# Altium schematic sheet STM32F407.SchDoc
size D
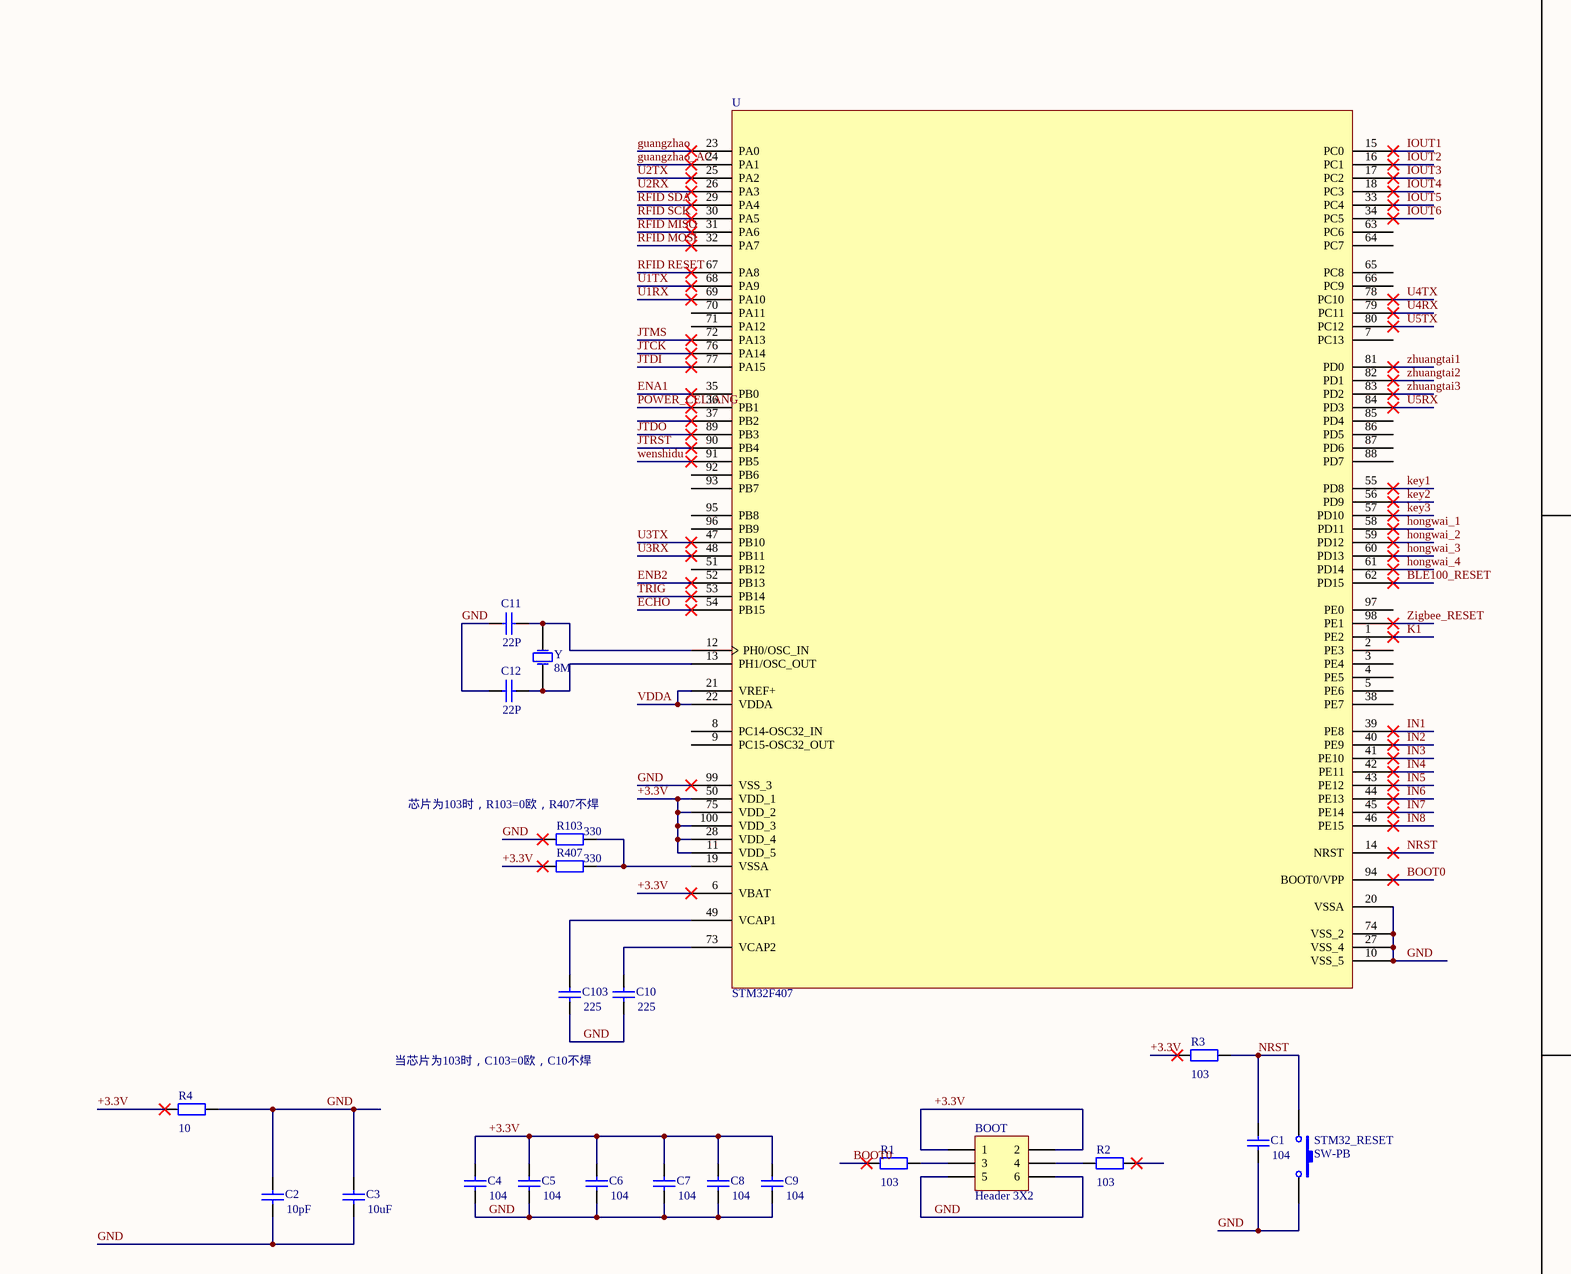
[diagram p0: STM32F407.SchDoc, top left]
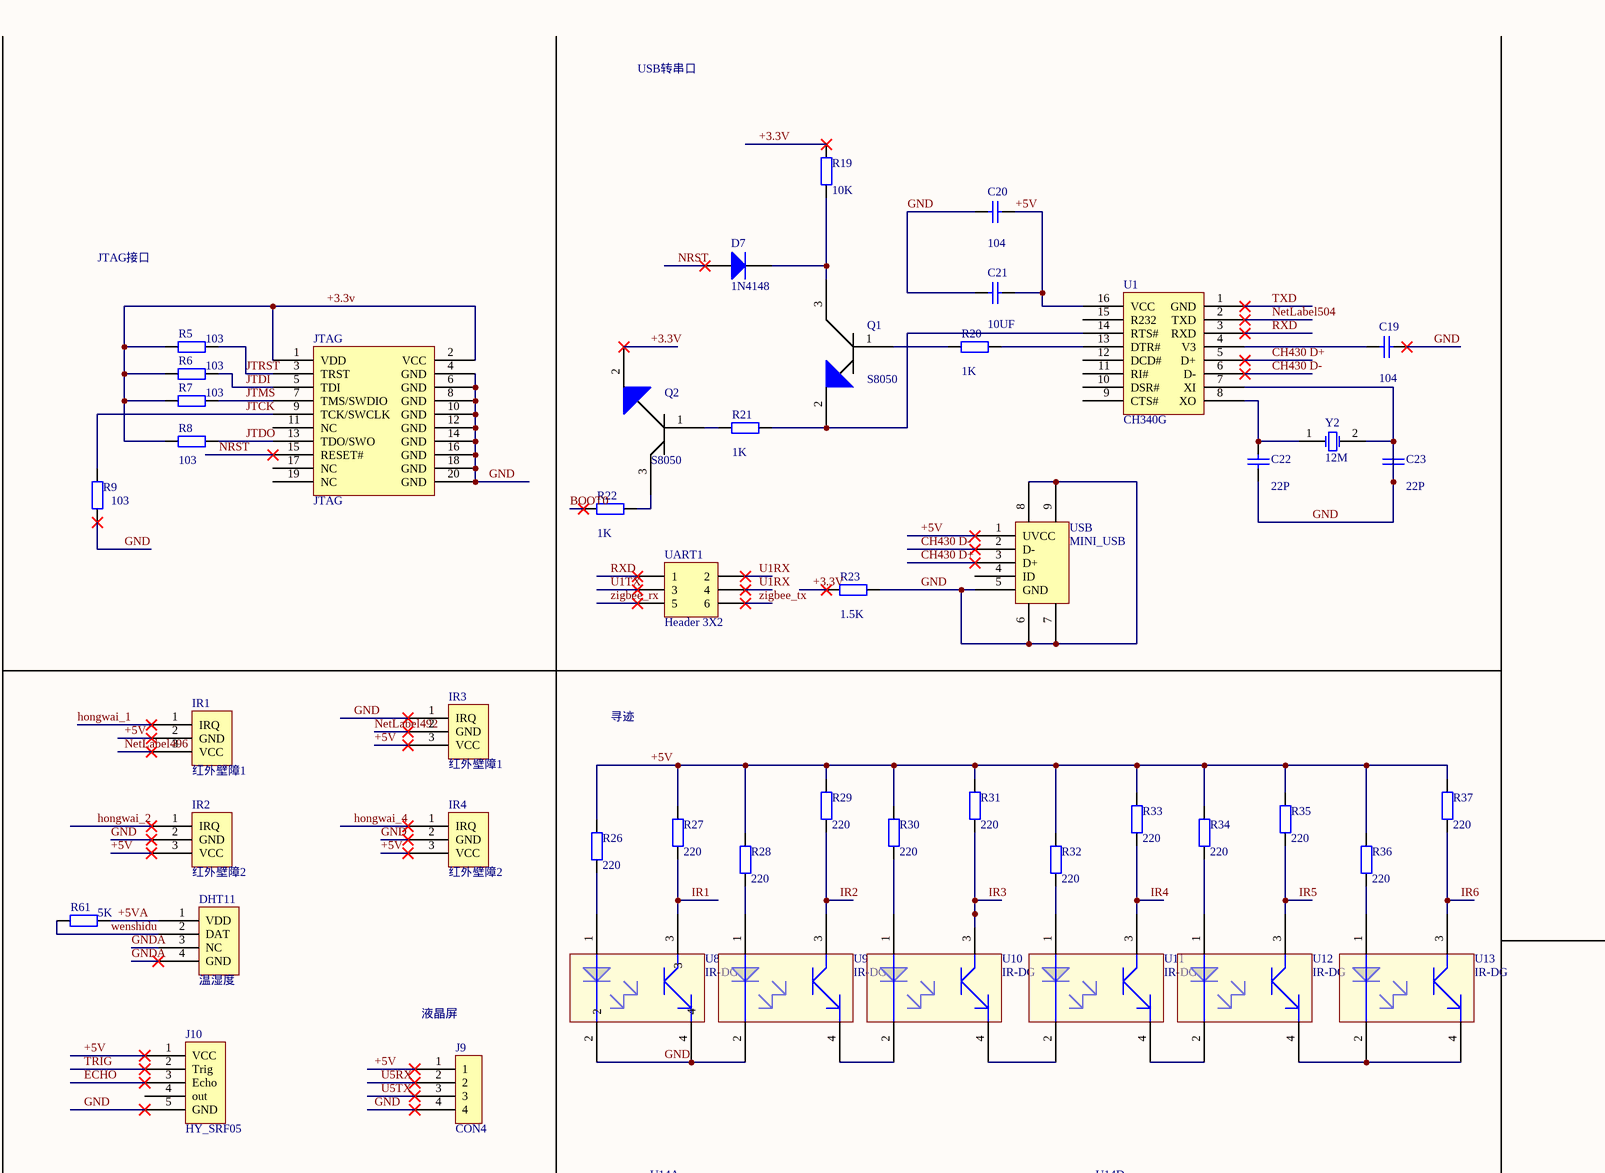
[diagram p1: STM32F407.SchDoc, top middle]
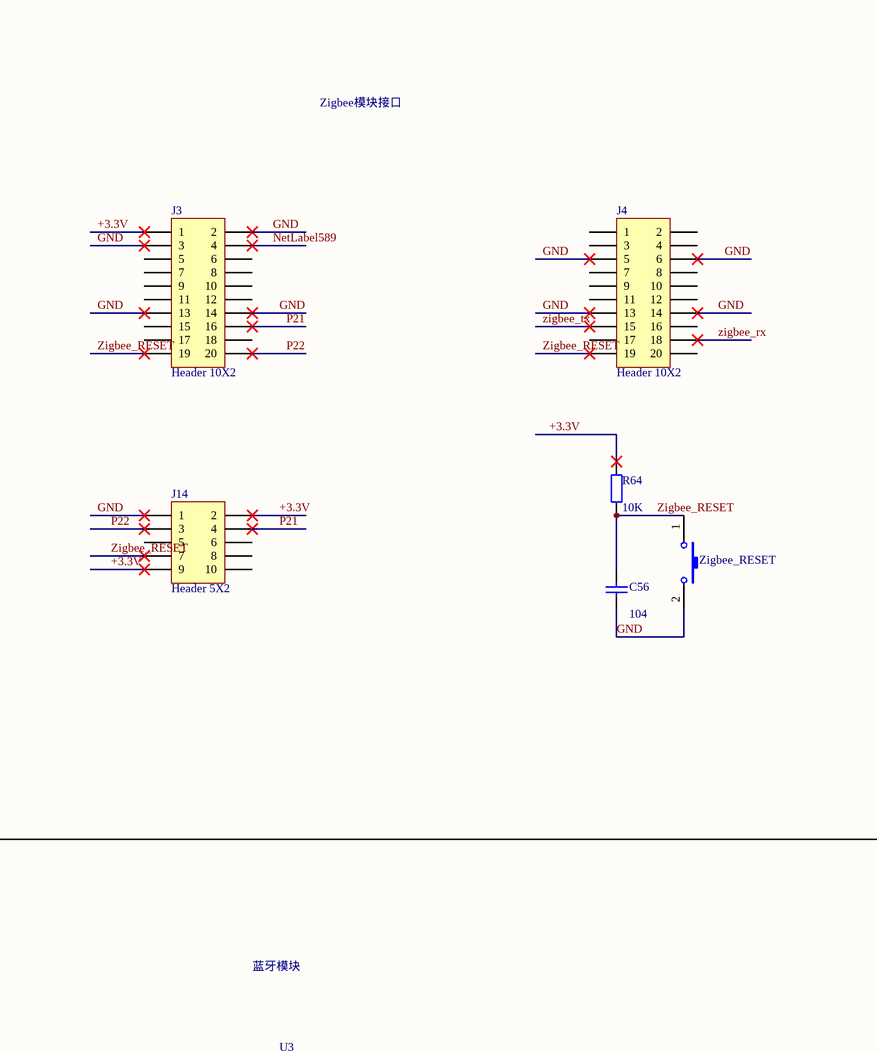
[diagram p2: STM32F407.SchDoc, top right]
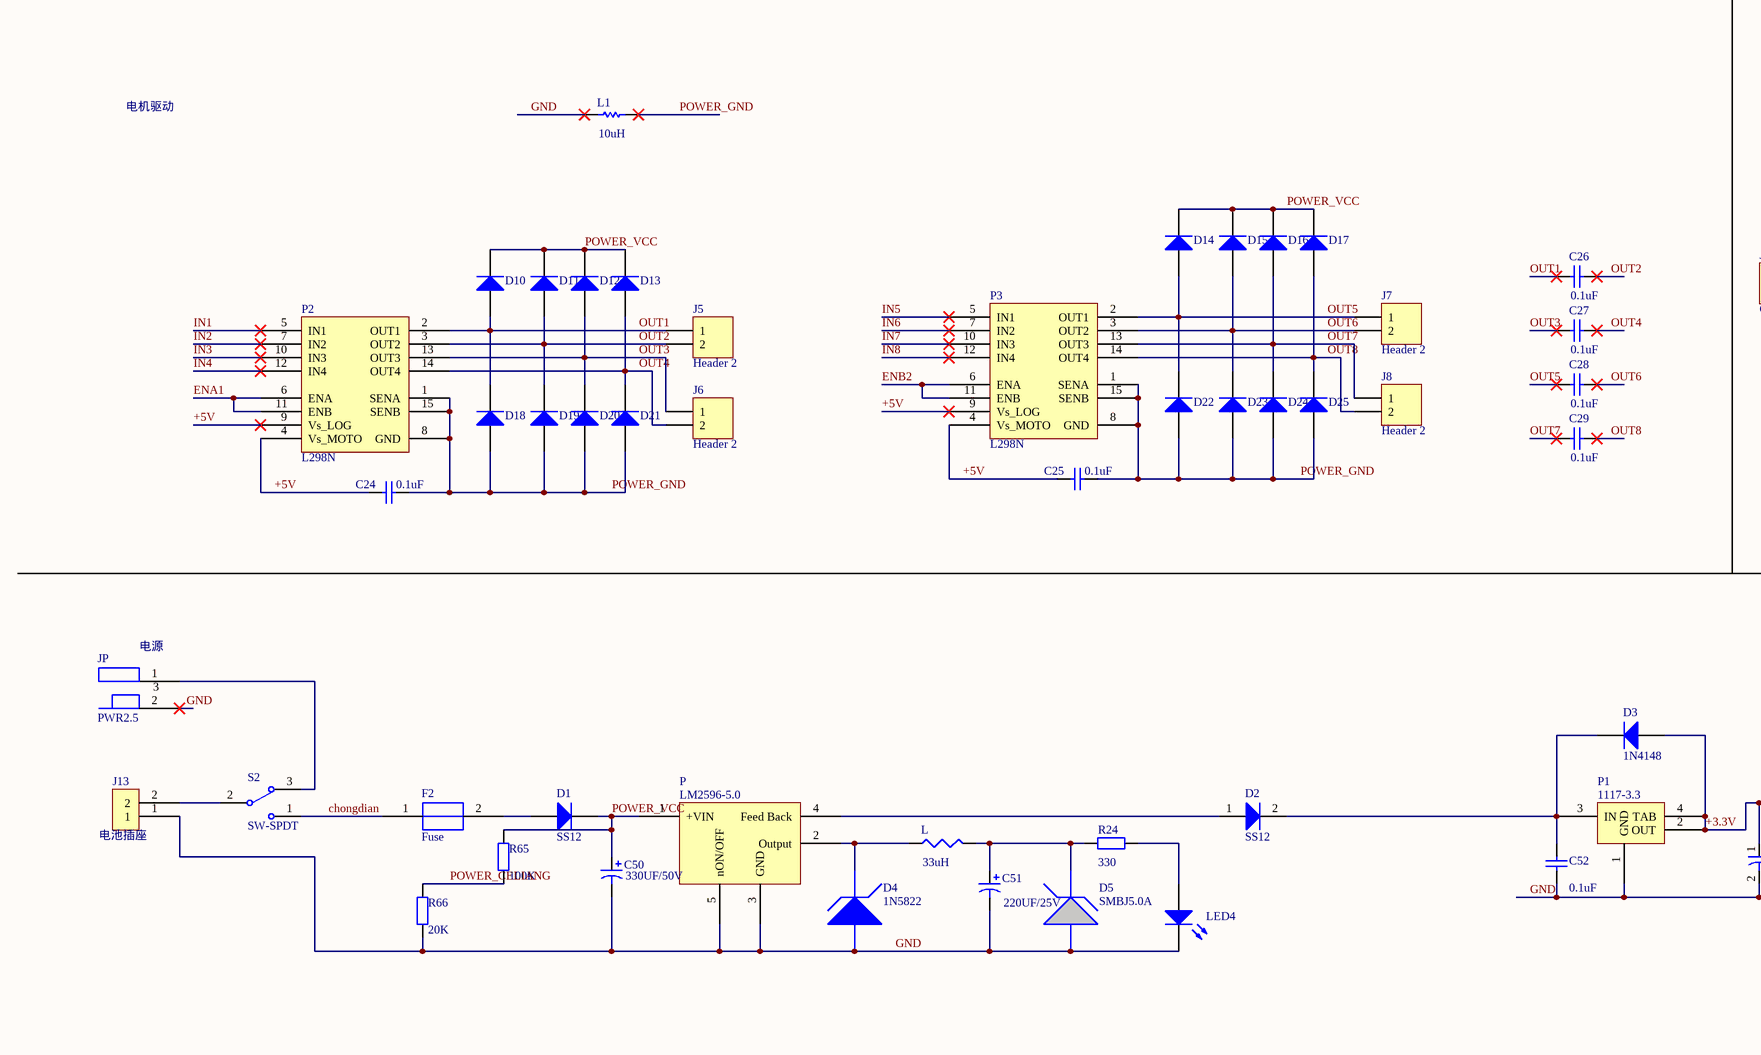
[diagram p3: STM32F407.SchDoc, bottom left]
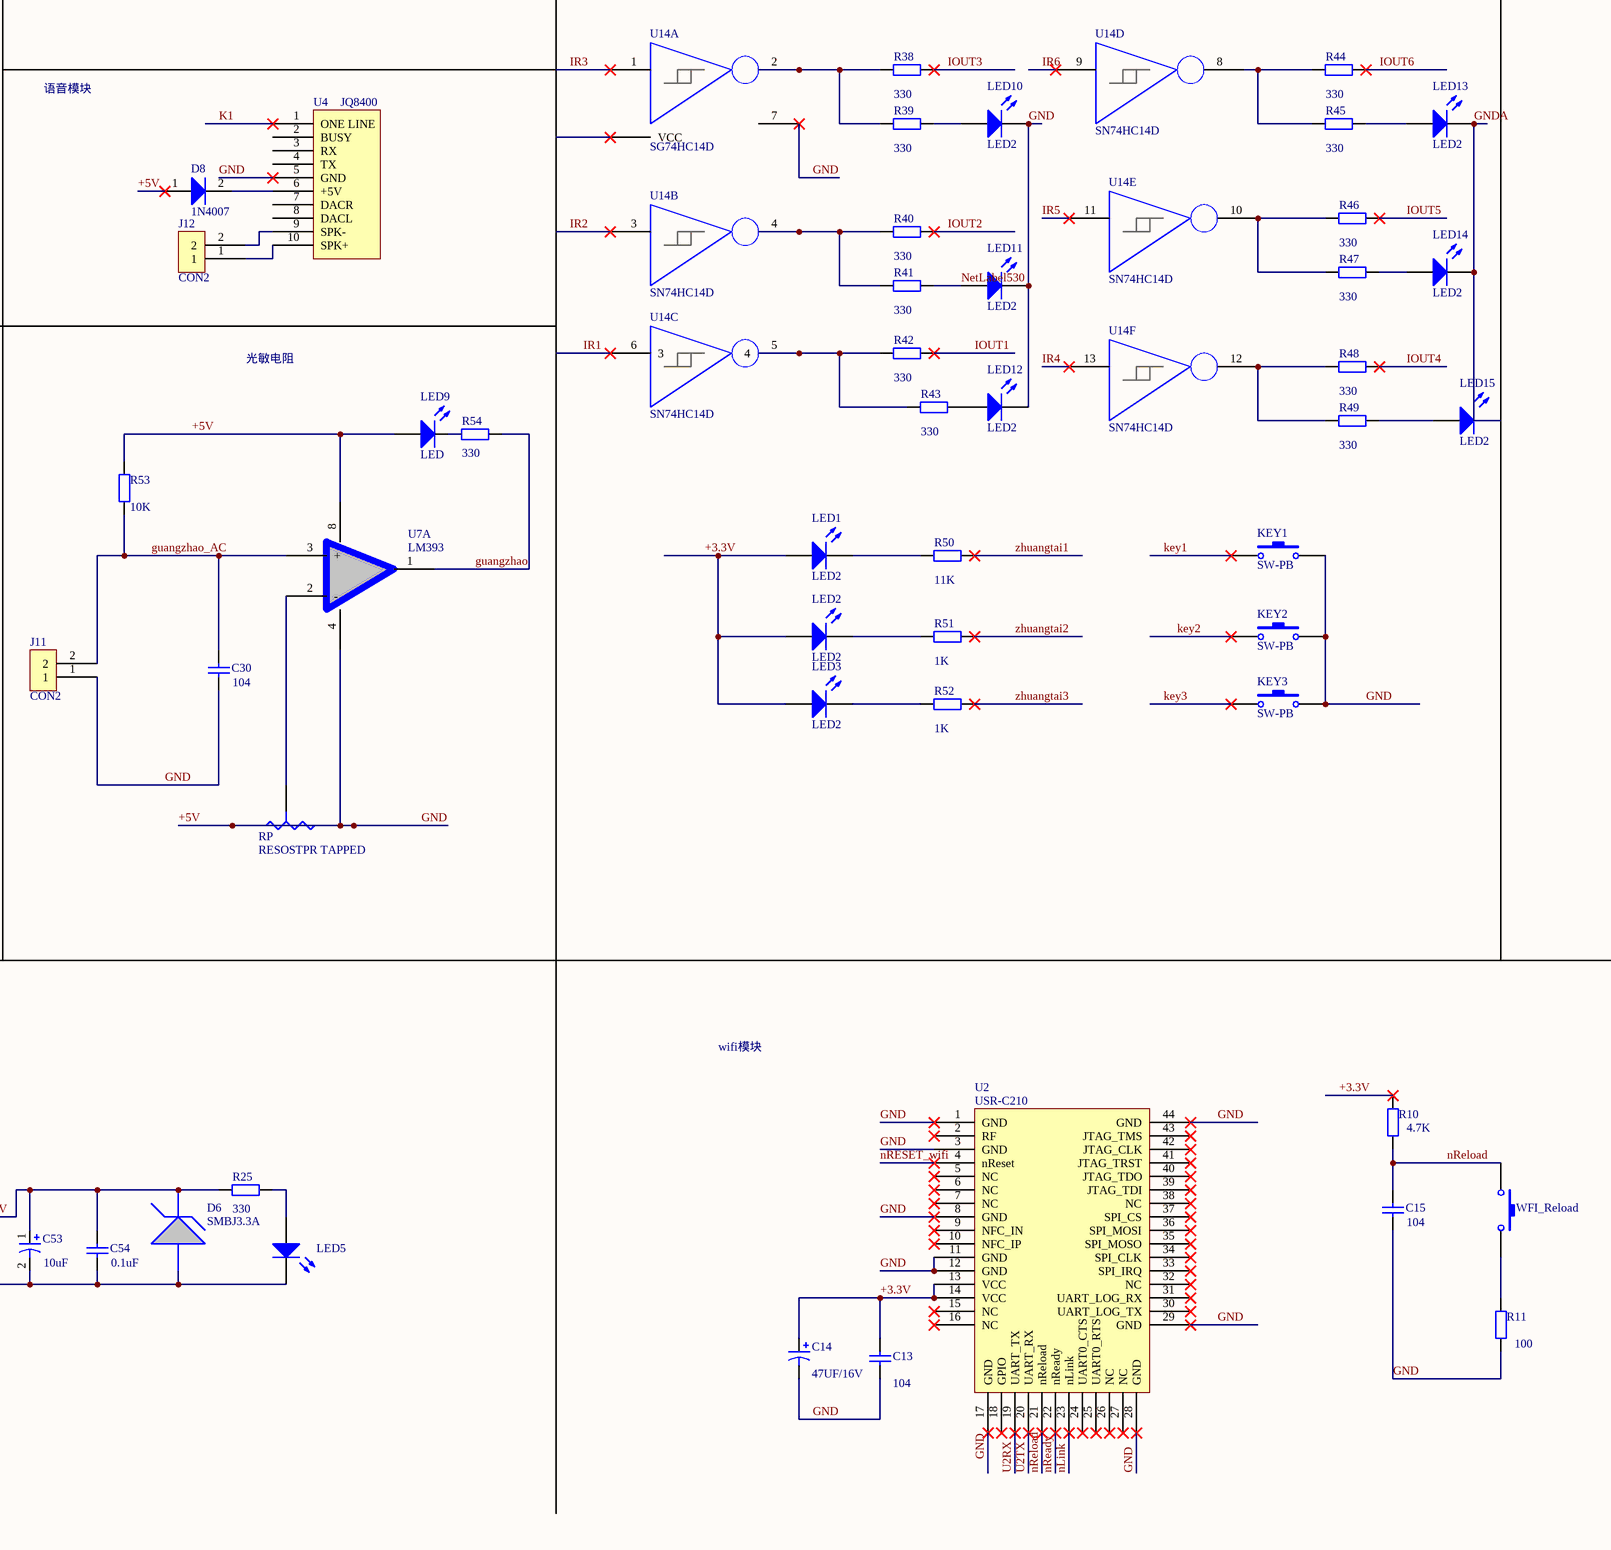
[diagram p4: STM32F407.SchDoc, bottom middle]
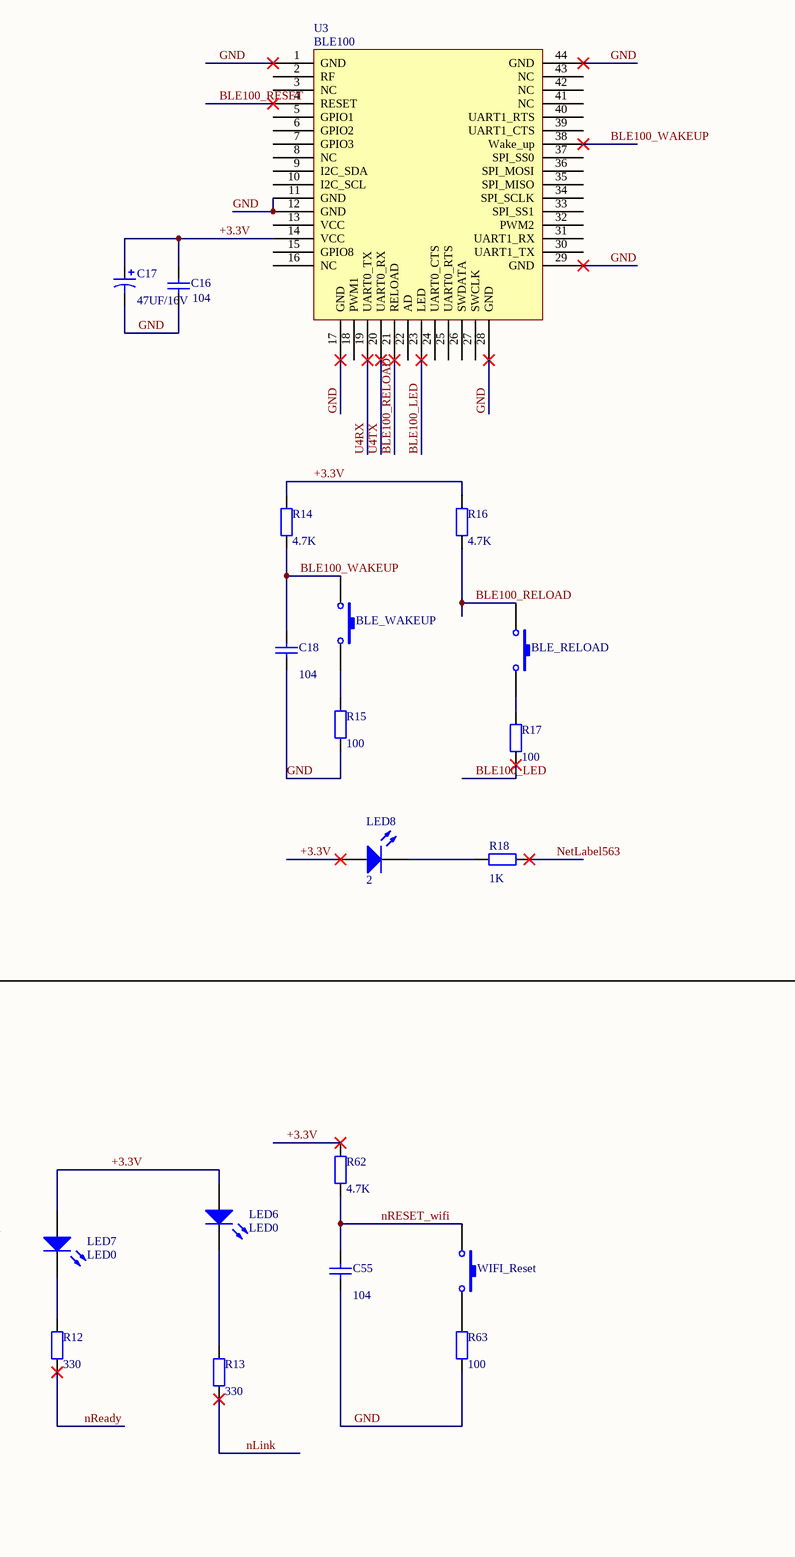
[diagram p5: STM32F407.SchDoc, bottom right]

## Parts
BLE_RELOAD  BLE_RELOAD  [Button_TP_L]
BLE_WAKEUP  BLE_WAKEUP  [Button_TP_L]
BOOT  Header 3X2  [HDR2X3]
C1  value 104  [1608[0603]C]
C2  value 10pF  [1608[0603]C]
C3  value 10uF  [1608[0603]C]
C4  value 104  [1608[0603]C]
C5  value 104  [1608[0603]C]
C6  value 104  [1608[0603]C]
C7  value 104  [1608[0603]C]
C8  value 104  [1608[0603]C]
C9  value 104  [1608[0603]C]
C10  value 225  [1608[0603]C]
C11  value 22P  [1608[0603]C]
C12  value 22P  [1608[0603]C]
C13  value 104  [1608[0603]C]  (hidden comment: Cap)
C14  value 47UF/16V  [3216[1206]C]  (hidden comment: Cap Pol1)
C15  value 104  [1608[0603]C]  (hidden comment: Cap)
C16  value 104  [1608[0603]C]  (hidden comment: Cap)
C17  value 47UF/16V  [3216[1206]C]  (hidden comment: Cap Pol1)
C18  value 104  [1608[0603]C]  (hidden comment: Cap)
C19  value 104  [RAD-0.3]  (hidden comment: Cap)
C20  value 104  [1608[0603]C]  (hidden comment: Cap)
C21  value 10UF  [1608[0603]C]  (hidden comment: Cap)
C22  value 22P  [1608[0603]C]  (hidden comment: Cap)
C23  value 22P  [1608[0603]C]  (hidden comment: Cap)
C24  value 0.1uF  [RAD-0.3]
C25  value 0.1uF  [RAD-0.3]
C26  value 0.1uF  [1608[0603]C]  (hidden comment: Cap)
C27  value 0.1uF  [1608[0603]C]  (hidden comment: Cap)
C28  value 0.1uF  [1608[0603]C]  (hidden comment: Cap)
C29  value 0.1uF  [1608[0603]C]  (hidden comment: Cap)
C30  value 104  [1608[0603]C]
C50  value 330UF/50V  [3216[1206]C]  (hidden comment: Cap Pol1)
C51  value 220UF/25V  [3216[1206]C]  (hidden comment: Cap Pol1)
C52  value 0.1uF  [1608[0603]C]  (hidden comment: Cap)
C53  value 10uF  [3216[1206]C]  (hidden comment: Cap Pol1)
C54  value 0.1uF  [1608[0603]C]  (hidden comment: Cap)
C55  value 104  [1608[0603]C]  (hidden comment: Cap)
C56  value 104  [1608[0603]C]  (hidden comment: Cap)
C103  value 225  [1608[0603]C]
D1  SS12  [DIODE-T]
D2  SS12  [DIODE-T]
D3  1N4148  [DIODE-T]
D4  1N5822  [DIODE-7/3]
D5  SMBJ5.0A  [DIODE-7/3]
D6  SMBJ3.3A  [DIODE-7/3]
D7  1N4148  [DIODE-T]
D8  1N4007  [DIODE-7/3]
D10  Diode  [DIODE-T]  (value not drawn)
D11  Diode  [DIODE-T]  (value not drawn)
D12  Diode  [DIODE-T]  (value not drawn)
D13  Diode  [DIODE-T]  (value not drawn)
D14  Diode  [DIODE-T]  (value not drawn)
D15  Diode  [DIODE-T]  (value not drawn)
D16  Diode  [DIODE-T]  (value not drawn)
D17  Diode  [DIODE-T]  (value not drawn)
D18  Diode  [DIODE-T]  (value not drawn)
D19  Diode  [DIODE-T]  (value not drawn)
D20  Diode  [DIODE-T]  (value not drawn)
D21  Diode  [DIODE-T]  (value not drawn)
D22  Diode  [DIODE-T]  (value not drawn)
D23  Diode  [DIODE-T]  (value not drawn)
D24  Diode  [DIODE-T]  (value not drawn)
D25  Diode  [DIODE-T]  (value not drawn)
DHT11  温湿度  [DHT11]
F2  Fuse  [FUSE]
IR1  红外壁障1  [IR]
IR2  红外壁障2  [IR]
IR3  红外壁障1  [IR]
IR4  红外壁障2  [IR]
J3  Header 10X2  [HDR2X10]
J4  Header 10X2  [HDR2X10]
J5  Header 2  [HDR1X2]
J6  Header 2  [HDR1X2]
J7  Header 2  [HDR1X2]
J8  Header 2  [HDR1X2]
J9  CON4  [液晶屏3.5]
J10  HY_SRF05  [RELAY5]
J11  CON2  [HDR1X2]
J12  CON2  [HDR1X2]
J13  电池插座  [电源座子]  (value not drawn)
J14  Header 5X2  [HDR2X5]
JP  PWR2.5  [SIP2]
JTAG  JTAG  [JTAG_20]
KEY1  SW-PB  [Button_TP_L]
KEY2  SW-PB  [Button_TP_L]
KEY3  SW-PB  [Button_TP_L]
L  value 33uH  [FCC05-20A]
L1  value 10uH  [FCC05-20A]
LED1  LED2  [1608[0603]LED]
LED2  LED2  [1608[0603]LED]
LED3  LED2  [1608[0603]LED]
LED4  LED4  [1608[0603]LED]
LED5  LED0  [1608[0603]LED]  (value not drawn)
LED6  LED0  [1608[0603]LED]
LED7  LED0  [1608[0603]LED]
LED8  2  [1608[0603]LED]
LED9  LED  [1608[0603]LED]
LED10  LED2  [1608[0603]LED]
LED11  LED2  [1608[0603]LED]
LED12  LED2  [1608[0603]LED]
LED13  LED2  [1608[0603]LED]
LED14  LED2  [1608[0603]LED]
LED15  LED2  [1608[0603]LED]
P  LM2596-5.0  [LM2596]
P1  1117-3.3  [SOT-23]
P2  L298N  [L298N]
P3  L298N  [L298N]
Q1  S8050  [TO-92]
Q2  S8050  [TO-92]
R1  value 103  [1608[0603]R]
R2  value 103  [1608[0603]R]
R3  value 103  [1608[0603]R]
R4  value 10  [1608[0603]R]
R5  value 103  [1608[0603]R]
R6  value 103  [1608[0603]R]
R7  value 103  [1608[0603]R]
R8  value 103  [1608[0603]R]
R9  value 103  [1608[0603]R]
R10  value 4.7K  [1608[0603]R]  (hidden comment: Res2)
R11  value 100  [1608[0603]R]  (hidden comment: Res2)
R12  value 330  [1608[0603]R]  (hidden comment: Res2)
R13  330  [1608[0603]R]
R14  value 4.7K  [1608[0603]R]  (hidden comment: Res2)
R15  value 100  [1608[0603]R]  (hidden comment: Res2)
R16  value 4.7K  [1608[0603]R]  (hidden comment: Res2)
R17  value 100  [1608[0603]R]  (hidden comment: Res2)
R18  value 1K  [1608[0603]R]  (hidden comment: Res2)
R19  value 10K  [1608[0603]R]  (hidden comment: Res2)
R20  value 1K  [1608[0603]R]  (hidden comment: Res2)
R21  value 1K  [AXIAL-0.4]  (hidden comment: Res2)
R22  value 1K  [1608[0603]R]  (hidden comment: Res2)
R23  value 1.5K  [1608[0603]R]  (hidden comment: Res2)
R24  value 330  [1608[0603]R]  (hidden comment: Res2)
R25  value 330  [1608[0603]R]  (hidden comment: Res2)
R26  value 220  [1608[0603]R]  (hidden comment: Res2)
R27  value 220  [1608[0603]R]  (hidden comment: Res2)
R28  value 220  [1608[0603]R]  (hidden comment: Res2)
R29  value 220  [1608[0603]R]  (hidden comment: Res2)
R30  value 220  [1608[0603]R]  (hidden comment: Res2)
R31  value 220  [1608[0603]R]  (hidden comment: Res2)
R32  value 220  [1608[0603]R]  (hidden comment: Res2)
R33  value 220  [1608[0603]R]  (hidden comment: Res2)
R34  value 220  [1608[0603]R]  (hidden comment: Res2)
R35  value 220  [1608[0603]R]  (hidden comment: Res2)
R36  value 220  [1608[0603]R]  (hidden comment: Res2)
R37  value 220  [1608[0603]R]  (hidden comment: Res2)
R38  value 330  [1608[0603]R]  (hidden comment: Res2)
R39  value 330  [1608[0603]R]  (hidden comment: Res2)
R40  value 330  [1608[0603]R]  (hidden comment: Res2)
R41  value 330  [1608[0603]R]  (hidden comment: Res2)
R42  value 330  [1608[0603]R]  (hidden comment: Res2)
R43  value 330  [1608[0603]R]  (hidden comment: Res2)
R44  value 330  [1608[0603]R]  (hidden comment: Res2)
R45  value 330  [1608[0603]R]  (hidden comment: Res2)
R46  value 330  [1608[0603]R]  (hidden comment: Res2)
R47  value 330  [1608[0603]R]  (hidden comment: Res2)
R48  value 330  [1608[0603]R]  (hidden comment: Res2)
R49  value 330  [1608[0603]R]  (hidden comment: Res2)
R50  value 11K  [1608[0603]R]  (hidden comment: Res2)
R51  value 1K  [1608[0603]R]  (hidden comment: Res2)
R52  value 1K  [1608[0603]R]  (hidden comment: Res2)
R53  value 10K  [1608[0603]R]  (hidden comment: Res2)
R54  value 330  [1608[0603]R]
R61  value 5K  [AXIAL-0.4]
R62  value 4.7K  [1608[0603]R]  (hidden comment: Res2)
R63  value 100  [AXIAL-0.4]  (hidden comment: Res2)
R64  value 10K  [1608[0603]R]  (hidden comment: Res2)
R65  value 100K  [1608[0603]R]  (hidden comment: Res2)
R66  value 20K  [1608[0603]R]  (hidden comment: Res2)
R103  value 330  [1608[0603]R]
R407  value 330  [1608[0603]R]
RP  RESOSTPR TAPPED  [SOT-23]
S2  SW-SPDT  [SIP3]
STM32_RESET  SW-PB  [SIP2]
U  STM32F407  [STM-LQFP100_M]
U1  CH340G  [SOP16]
U2  USR-C210  [USR-C322-PCB]
U3  BLE100  [USR-C322-PCB]
U4  JQ8400  [JQ8400]
U7A  LM393  [SOP-8]
U8  IR-DG  [IR]
U9  IR-DG  [IR]
U10  IR-DG  [IR]
U11  IR-DG  [IR]
U12  IR-DG  [IR]
U13  IR-DG  [IR]
U14A  SG74HC14D  [SOP16]
U14B  SN74HC14D  [SOP14S]
U14C  SN74HC14D  [SOP14S]
U14D  SN74HC14D  [SOP14S]
U14E  SN74HC14D  [SOP14S]
U14F  SN74HC14D  [SOP14S]
UART1  Header 3X2  [HDR2X3]
USB  MINI_USB  [USB-MINI]
WFI_Reload  WFI_Reload  [Button_TP_L]
WIFI_Reset  WIFI_Reset  [Button_TP_L]
Y  8M  [CRYSTAL]
Y2  12M  [XTAL_US]
Zigbee_RESET  Zigbee_RESET  [Button_TP_L]

## Nets
+3.3V: BOOT.1 BOOT.2 C4.2 C5.2 C6.2 C7.2 C8.2 C9.2 C13.2 C14.1 C16.2 C17.1 C53.1 C54.2 D3.1(A) D6.2 J3.1 J14.2 J14.9 JTAG.1(VDD) JTAG.2(VCC) LED1.1(A) LED2.1(A) LED3.1(A) LED6.1(A) LED7.1(A) LED8.1(A) P1.2(OUT) P1.4(TAB) Q2.2 R3.1 R4.1 R5.1 R6.1 R7.1 R8.1 R10.2 R14.2 R16.2 R19.2 R23.1 R25.1 R62.1 R64.2 R407.1 U.6(VBAT) U.11(VDD_5) U.28(VDD_4) U.50(VDD_1) U.75(VDD_2) U.100(VDD_3) U2.13(VCC) U2.14(VCC) U3.14(VCC)
+5V: BOOT.5 BOOT.6 C1.1 C2.1 C2.2 C3.1 C3.2 C4.1 C5.1 C6.1 C7.1 C8.1 C9.1 C10.1 C11.1 C12.1 C13.1 C14.2 C15.2 C16.1 C17.2 C18.2 C19.2 C20.1 C20.2 C21.1 C21.2 C22.1 C23.1 C23.2 C24.1 C25.1 C30.1 C50.2 C51.2 C52.1 C53.2 C54.1 C55.1 C56.1 C103.1 D4.1 D5.1 D6.1 D8.1(A) IR1.2(GND) IR2.2(GND) IR2.3(VCC) IR3.1(IRQ) IR3.3(VCC) IR4.2(GND) IR4.3(VCC) J3.2 J3.3 J3.13 J3.14 J4.5 J4.6 J4.13 J4.14 J9.1 J9.4 J10.1(VCC) J10.5(GND) J11.1 J13.1 J14.1 JP.2 JTAG.4(GND) JTAG.6(GND) JTAG.8(GND) JTAG.10(GND) JTAG.12(GND) JTAG.14(GND) JTAG.16(GND) JTAG.18(GND) JTAG.20(GND) KEY1.2 KEY2.2 KEY3.2 L1.1 LED4.2(K) LED5.2(K) LED9.1(A) LED10.2(K) LED11.2(K) LED12.2(K) P.3(GND) P.5(nON/OFF) P1.1(GND) P2.4(Vs_MOTO) P2.9(Vs_LOG) P3.4(Vs_MOTO) P3.9(Vs_LOG) R4.2 R9.1 R11.1 R15.1 R23.2 R26.2 R27.2 R28.2 R29.2 R30.2 R31.2 R32.2 R33.2 R34.2 R35.2 R36.2 R37.2 R53.2 R63.1 R66.1 R103.1 RP.1(A) RP.2(B) STM32_RESET.2 U.10(VSS_5) U.20(VSSA) U.27(VSS_4) U.74(VSS_2) U.99(VSS_3) U1.7(XI) U1.16(VCC) U2.1(GND) U2.3(GND) U2.8(GND) U2.11(GND) U2.12(GND) U2.17(GND) U2.28(GND) U2.29(GND) U2.44(GND) U3.1(GND) U3.11(GND) U3.12(GND) U3.17(GND) U3.28(GND) U3.29(GND) U3.44(GND) U4.5(GND) U7A.4 U7A.8 U8.2 U8.4 U9.2 U14A.7 USB.1(UVCC) USB.5(GND) USB.6 USB.7 USB.8 USB.9 Y2.2(OSC2) Zigbee_RESET.2  [also labelled GND]
+5VA: DHT11.1(VDD) R61.2
BLE100_LED: R17.1 U3.23(LED)
BLE100_RELOAD: BLE_RELOAD.1 R16.1 U3.21(RELOAD)
BLE100_RESET: U.62(PD15) U3.4(RESET)
BLE100_WAKEUP: BLE_WAKEUP.1 C18.1 R14.1 U3.38(Wake_up)
BOOT0: R1.1 R22.1 U.94(BOOT0/VPP)
CH430 D+: U1.5(D+) USB.3(D+)
CH430 D-: U1.6(D-) USB.2(D-)
chongdian: F2.1 S2.1
ECHO: J10.3(Echo) U.54(PB15)
ENA1: P2.6(ENA) P2.11(ENB) U.35(PB0)
ENB2: P3.6(ENA) P3.11(ENB) U.52(PB13)
GNDA: DHT11.3(NC) DHT11.4(GND) LED13.2(K) LED14.2(K) LED15.2(K)
guangzhao: R54.2 U.23(PA0) U7A.1
guangzhao_AC: C30.2 J11.2 R53.1 U.24(PA1) U7A.3(+)
hongwai_1: IR1.1(IRQ) U.58(PD11)
hongwai_2: IR2.1(IRQ) U.59(PD12)
hongwai_3: U.60(PD13)
hongwai_4: IR4.1(IRQ) U.61(PD14)
IN1: P2.5(IN1) U.39(PE8)
IN2: P2.7(IN2) U.40(PE9)
IN3: P2.10(IN3) U.41(PE10)
IN4: P2.12(IN4) U.42(PE11)
IN5: P3.5(IN1) U.43(PE12)
IN6: P3.7(IN2) U.44(PE13)
IN7: P3.10(IN3) U.45(PE14)
IN8: P3.12(IN4) U.46(PE15)
IOUT1: R42.2 U.15(PC0)
IOUT2: R40.2 U.16(PC1)
IOUT3: R38.2 U.17(PC2)
IOUT4: R48.2 U.18(PC3)
IOUT5: R46.2 U.33(PC4)
IOUT6: R44.2 U.34(PC5)
IR1: R27.1 U8.3 U14C.6(3)
IR2: R29.1 U9.3 U14B.3
IR3: R31.1 U10.3 U14A.1
IR4: R33.1 U11.3 U14F.13
IR5: R35.1 U12.3 U14E.11
IR6: R37.1 U13.3 U14D.9
JTCK: JTAG.9(TCK/SWCLK) R9.2 U.76(PA14)
JTDI: JTAG.5(TDI) R6.2 U.77(PA15)
JTDO: JTAG.13(TDO/SWO) R8.2 U.89(PB3)
JTMS: JTAG.7(TMS/SWDIO) R7.2 U.72(PA13)
JTRST: JTAG.3(TRST) R5.2 U.90(PB4)
K1: U.1(PE2) U4.1(ONE_LINE)
key1: KEY1.1 U.55(PD8)
key2: KEY2.1 U.56(PD9)
key3: KEY3.1 U.57(PD10)
NetLabel492: IR3.2(GND)
NetLabel496: IR1.3(VCC)
NetLabel504: U1.2(TXD)
NetLabel530: LED11.1(A) R41.2
NetLabel563: R18.2
NetLabel589: J3.4
nLink: R13.1 U2.23(nLink)
nReady: R12.1 U2.22(nReady)
nReload: C15.1 R10.1 U2.21(nReload) WFI_Reload.1
nRESET_wifi: C55.2 R62.2 U2.4(nReset) WIFI_Reset.1
NRST: C1.2 D7.1(A) JTAG.15(RESET#) R3.2 STM32_RESET.1 U.14(NRST)
OUT1: C26.1 D10.1(A) D18.2(K) J5.1 P2.2(OUT1)
OUT2: C26.2 D11.1(A) D19.2(K) J5.2 P2.3(OUT2)
OUT3: C27.1 D12.1(A) D20.2(K) J6.1 P2.13(OUT3)
OUT4: C27.2 D13.1(A) D21.2(K) J6.2 P2.14(OUT4)
OUT5: C28.1 D14.1(A) D22.2(K) J7.1 P3.2(OUT1)
OUT6: C28.2 D15.1(A) D23.2(K) J7.2 P3.3(OUT2)
OUT7: C29.1 D16.1(A) D24.2(K) J8.1 P3.13(OUT3)
OUT8: C29.2 D17.1(A) D25.2(K) J8.2 P3.14(OUT4)
P21: J3.16 J14.4
P22: J3.20 J14.3
POWER_CELIANG: R65.1 R66.2 U.36(PB1)
POWER_GND: C24.2 C25.2 D18.1(A) D19.1(A) D20.1(A) D21.1(A) D22.1(A) D23.1(A) D24.1(A) D25.1(A) L1.2 P2.1(SENA) P2.8(GND) P2.15(SENB) P3.1(SENA) P3.8(GND) P3.15(SENB)
POWER_VCC: C50.1 D1.2(K) D10.2(K) D11.2(K) D12.2(K) D13.2(K) D14.2(K) D15.2(K) D16.2(K) D17.2(K) P.1(+VIN) R65.2
RFID MISO: U.31(PA6)
RFID MOSI: U.32(PA7)
RFID RESET: U.67(PA8)
RFID SCK: U.30(PA5)
RFID SDA: U.29(PA4)
RXD: U1.3(RXD) UART1.1
TRIG: J10.2(Trig) U.53(PB14)
TXD: U1.1(GND)
U1RX: U.69(PA10) UART1.2 UART1.4
U1TX: U.68(PA9) UART1.3
U2RX: U.26(PA3) U2.19(UART_TX)
U2TX: U.25(PA2) U2.20(UART_RX)
U3RX: U.48(PB11)
U3TX: U.47(PB10)
U4RX: U.79(PC11) U3.19(UART0_TX)
U4TX: U.78(PC10) U3.20(UART0_RX)
U5RX: J9.2 U.84(PD3)
U5TX: J9.3 U.80(PC12)
VDDA: U.21(VREF+) U.22(VDDA)
wenshidu: DHT11.2(DAT) R61.1 U.91(PB5)
zhuangtai1: R50.2 U.81(PD0)
zhuangtai2: R51.2 U.82(PD1)
zhuangtai3: R52.2 U.83(PD2)
Zigbee_RESET: C56.2 J3.19 J4.19 J14.7 R64.1 U.98(PE1) Zigbee_RESET.1
zigbee_rx: J4.18 UART1.5
zigbee_tx: J4.15 UART1.6
NetBLE_RELOAD_2: BLE_RELOAD.2 R17.2
NetBLE_WAKEUP_2: BLE_WAKEUP.2 R15.2
NetBOOT_3: BOOT.3 R1.2
NetBOOT_4: BOOT.4 R2.1
NetC10_2: C10.2 U.73(VCAP2)
NetC11_2: C11.2 U.12(PH0/OSC_IN) Y.1(OSC1)
NetC12_2: C12.2 U.13(PH1/OSC_OUT) Y.2(OSC2)
NetC19_1: C19.1 U1.4(V3)
NetC22_2: C22.2 U1.8(XO) Y2.1(OSC1)
NetC51_1: C51.1 D5.2 L.2 R24.1
NetC52_2: C52.2 D2.2(K) D3.2(K) P1.3(IN)
NetC103_2: C103.2 U.49(VCAP1)
NetD1_1: D1.1(A) F2.2
NetD2_1: D2.1(A) P.4(Feed_Back)
NetD4_2: D4.2 L.1 P.2(Output)
NetD7_2: D7.2(K) Q1.3 R19.1
NetD8_2: D8.2(K) U4.6(+5V)
NetJ12_1: J12.1 U4.10(SPK+)
NetJ12_2: J12.2 U4.9(SPK-)
NetJ13_2: J13.2 S2.2
NetJP_1: JP.1 S2.3
NetLED1_2: LED1.2(K) R50.1
NetLED2_2: LED2.2(K) R51.1
NetLED3_2: LED3.2(K) R52.1
NetLED4_1: LED4.1(A) R24.2
NetLED5_1: LED5.1(A) R25.2
NetLED6_2: LED6.2(K) R13.2
NetLED7_2: LED7.2(K) R12.2
NetLED8_2: LED8.2(K) R18.1
NetLED9_2: LED9.2(K) R54.1
NetLED10_1: LED10.1(A) R39.2
NetLED12_1: LED12.1(A) R43.2
NetLED13_1: LED13.1(A) R45.2
NetLED14_1: LED14.1(A) R47.2
NetLED15_1: LED15.1(A) R49.2
NetQ1_1: Q1.1 R20.1
NetQ1_2: Q1.2 R21.2 U1.14(RTS#)
NetQ2_1: Q2.1 R21.1
NetQ2_3: Q2.3 R22.2
NetR11_2: R11.2 WFI_Reload.2
NetR20_2: R20.2 U1.13(DTR#)
NetR26_1: R26.1 U8.1
NetR28_1: R28.1 U9.1
NetR30_1: R30.1 U10.1
NetR32_1: R32.1 U11.1
NetR34_1: R34.1 U12.1
NetR36_1: R36.1 U13.1
NetR38_1: R38.1 R39.1 U14A.2
NetR40_1: R40.1 R41.1 U14B.4
NetR42_1: R42.1 R43.1 U14C.5(4)
NetR44_1: R44.1 R45.1 U14D.8
NetR46_1: R46.1 R47.1 U14E.10
NetR48_1: R48.1 R49.1 U14F.12
NetR63_2: R63.2 WIFI_Reset.2
NetR103_2: R103.2 R407.2 U.19(VSSA)
NetRP_3: RP.3(TAP) U7A.2(-)
NetU9_4: U9.4 U10.2
NetU10_4: U10.4 U11.2
NetU11_4: U11.4 U12.2
NetU12_4: U12.4 U13.2 U13.4

Not connected (* = marked no-connect by the designer): J3 5 6 7 8 9 10 11 12 15 17 18; J4 1 2 3 4 7 8 9 10 11 12 16 17 20; J10 4(out); J14 5 6 8 10; JTAG 11(NC) 17(NC) 19(NC); R2 2*; U 2(PE3) 3(PE4) 4(PE5) 5(PE6) 7(PC13) 8(PC14-OSC32_IN) 9(PC15-OSC32_OUT) 37(PB2)* 38(PE7) 51(PB12) 63(PC6) 64(PC7) 65(PC8) 66(PC9) 70(PA11) 71(PA12) 85(PD4) 86(PD5) 87(PD6) 88(PD7) 92(PB6) 93(PB7) 95(PB8) 96(PB9) 97(PE0); U1 9(CTS#) 10(DSR#) 11(RI#) 12(DCD#) 15(R232); U2 2(RF)* 5(NC)* 6(NC)* 7(NC)* 9(NFC_IN)* 10(NFC_IP)* 15(NC)* 16(NC)* 18(GPIO)* 24(UART0_CTS)* 25(UART0_RTS)* 26(NC)* 27(NC)* 30(UART_LOG_TX)* 31(UART_LOG_RX)* 32(NC)* 33(SPI_IRQ)* 34(SPI_CLK)* 35(SPI_MOSO)* 36(SPI_MOSI)* 37(SPI_CS)* 38(NC)* 39(JTAG_TDI)* 40(JTAG_TDO)* 41(JTAG_TRST)* 42(JTAG_CLK)* 43(JTAG_TMS)*; U3 2(RF) 3(NC) 5(GPIO1) 6(GPIO2) 7(GPIO3) 8(NC) 9(I2C_SDA) 10(I2C_SCL) 13(VCC) 15(GPIO8) 16(NC) 18(PWM1) 22(AD) 24(UART0_CTS) 25(UART0_RTS) 26(SWDATA) 27(SWCLK) 30(UART1_TX) 31(UART1_RX) 32(PWM2) 33(SPI_SS1) 34(SPI_SCLK) 35(SPI_MISO) 36(SPI_MOSI) 37(SPI_SS0) 39(UART1_CTS) 40(UART1_RTS) 41(NC) 42(NC) 43(NC); U4 2(BUSY) 3(RX) 4(TX) 7(DACR) 8(DACL); U14A VCC*; USB 4(ID)

## Notes on the sheet
- USB转串口
- Zigbee模块接口
- JTAG接口
- 寻迹
- (near R103) 芯片为103时，R103=0欧，R407不焊
- (near J9) 液晶屏
- 蓝牙模块
- 当芯片为103时，C103=0欧，C10不焊
- 语音模块
- 光敏电阻
- 电机驱动
- (near JP) 电源
- wifi模块
- (near J13) 电池插座
- Title
- Size:
- Date:
- File:
- D
- Number:
- Time:
- Revision:
- Sheet
- of
- (in symbol PWR2.5) 3

## Library data of the parts
BLE_RELOAD BLE_WAKEUP KEY1-KEY3 STM32_RESET WFI_Reload WIFI_Reset Zigbee_RESET = SW-PB: Switch; Published: 24-Mar-1999; LatestRevisionDate: 17-Jul-2002; LatestRevisionNote: Re-released for DXP Platform.; PackageReference: SPST-2; Publisher: Altium Limited
BOOT UART1 = Header 3X2: Header, 3-Pin, Dual row; LatestRevisionDate: 17-Jul-2002; LatestRevisionNote: Re-released for DXP Platform.; Publisher: Altium Limited
C1-C13 C15 C16 C18-C30 C52 C54-C56 C103 = Cap: Capacitor; Published: 8-Jun-2000; LatestRevisionDate: 17-Jul-2002; LatestRevisionNote: Re-released for DXP Platform.; PackageReference: RAD-0.3; Publisher: Altium Limited
C14 C17 C50 C51 C53 = Cap Pol1: Polarized Capacitor (Radial); Published: 8-Jun-2000; LatestRevisionDate: 17-Jul-2002; LatestRevisionNote: Re-released for DXP Platform.; PackageReference: RB7.6-15; Publisher: Altium Limited
D1-D3 D7 D8 D10-D25 = Diode: Default Diode; Published: 8-Jun-2000; LatestRevisionDate: 17-Jul-2002; LatestRevisionNote: Re-released for DXP Platform.; PackageDocument: Sep-1996; PackageReference: SMC; Publisher: Altium Limited; Code_JEDEC: DO-214-AB
D4 = 1N5822: 二极管
D5 D6 = SMBJ5.0A: 二极管
DHT11 = DHT11
IR1-IR4 = IR: 红外壁障
J3 J4 = Header 10X2: Header, 10-Pin, Dual row; LatestRevisionDate: 17-Jul-2002; LatestRevisionNote: Re-released for DXP Platform.; Publisher: Altium Limited
J5-J8 = Header 2: Header, 2-Pin; LatestRevisionDate: 17-Jul-2002; LatestRevisionNote: Re-released for DXP Platform.; Publisher: Altium Limited
J9 = CON4: 液晶屏
J10 = J10
J13 = CON2
J14 = Header 5X2: Header, 5-Pin, Dual row; LatestRevisionDate: 17-Jul-2002; LatestRevisionNote: Re-released for DXP Platform.; Publisher: Altium Limited
JP = PWR2.5: 滑动变阻器
L = Res3: Resistor; Published: 8-Jun-2000; LatestRevisionDate: 04-Mar-2005; LatestRevisionNote: PCB Footprint replaced.; PackageReference: J1-0603; Publisher: Altium Limited
L1 = Res1: Resistor; Published: 8-Jun-2000; LatestRevisionDate: 17-Jul-2002; LatestRevisionNote: Re-released for DXP Platform.; PackageReference: AXIAL-0.3; Publisher: Altium Limited
LED1-LED15 = LED0: Typical INFRARED GaAs LED; Published: 8-Jun-2000; LatestRevisionDate: 08-Jul-2005; LatestRevisionNote: Mech Layer 1 removed.; PackageReference: LED-0; Publisher: Altium Limited
Q2 = S8550
R1-R54 R61-R66 R103 R407 = Res2: Resistor; Published: 8-Jun-2000; LatestRevisionDate: 17-Jul-2002; LatestRevisionNote: Re-released for DXP Platform.; PackageReference: AXIAL-0.4; Publisher: Altium Limited
  R13: Value: 330
RP = Res Tap: Tapped Resistor; Sim Note: Enter the Resistance value and the set point into parameter fields.; Set Position: 0.5; Published: 24-Mar-1999; LatestRevisionDate: 17-Jul-2002; LatestRevisionNote: Re-released for DXP Platform.; PackageReference: VR3; Publisher: Altium Limited
S2 = SW-SPDT: SPDT Subminiature Toggle Switch, Right Angle Mounting, Vertical Actuation; Published: 24-Mar-1999; LatestRevisionDate: 17-Dec-2003; LatestRevisionNote: Schematic revised, PCB Footprint replaced.; DatasheetDocument: 05-Dec-2000; PackageReference: TL36WW15050; Publisher: Altium Limited; ComponentLink1Description: Manufacturer Link; ComponentLink1URL: http://www.apem.com
U2 = USR-C210: WIFI
U3 = BLE100: 蓝牙芯片
U4 = JQ8400: 语音芯片
Y Y2 = XTAL: Crystal Oscillator; Published: 8-Jun-2000; LatestRevisionDate: 17-Jul-2002; LatestRevisionNote: Re-released for DXP Platform.; PackageReference: R38; Publisher: Altium Limited